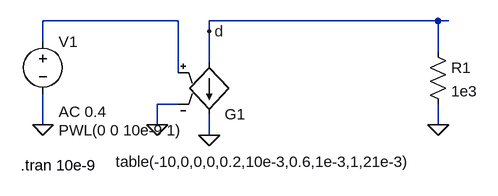
[diagram p0: schematic diodo_tunel.asc]
diodo_tunel.asc, the LTspice schematic file:
Version 4
SHEET 1 880 680
WIRE -368 -16 -576 -16
WIRE 32 -16 -320 -16
WIRE 48 -16 32 -16
WIRE -320 0 -320 -16
WIRE -576 16 -576 -16
WIRE 32 32 32 -16
WIRE -320 48 -320 0
WIRE -368 64 -368 -16
WIRE -368 112 -400 112
WIRE -576 144 -576 96
WIRE -400 144 -400 112
WIRE 32 144 32 112
WIRE -320 160 -320 128
FLAG -576 144 0
FLAG -320 0 d
FLAG -320 160 0
FLAG -400 144 0
FLAG 32 144 0
SYMBOL voltage -576 0 R0
WINDOW 3 24 152 Left 2
WINDOW 123 24 124 Left 2
WINDOW 39 0 0 Left 0
SYMATTR InstName V1
SYMATTR Value PWL(0 0 10e-9 1)
SYMATTR Value2 AC 0.4
SYMBOL g2 -320 144 M180
WINDOW 3 -144 -57 Left 2
SYMATTR Value table(-10,0,0,0,0.2,10e-3,0.6,1e-3,1,21e-3)
SYMATTR InstName G1
SYMBOL res 16 16 R0
SYMATTR InstName R1
SYMATTR Value 1e3
TEXT -610 206 Left 2 !.tran 10e-9

The netlist it stands for:
* diodo_tunel.asc
V1 N001 0 PWL(0 0 10e-9 1) AC 0.4
G1 d 0 N001 0 table(-10,0,0,0,0.2,10e-3,0.6,1e-3,1,21e-3)
R1 d 0 1e3
.tran 10e-9
.backanno
.end